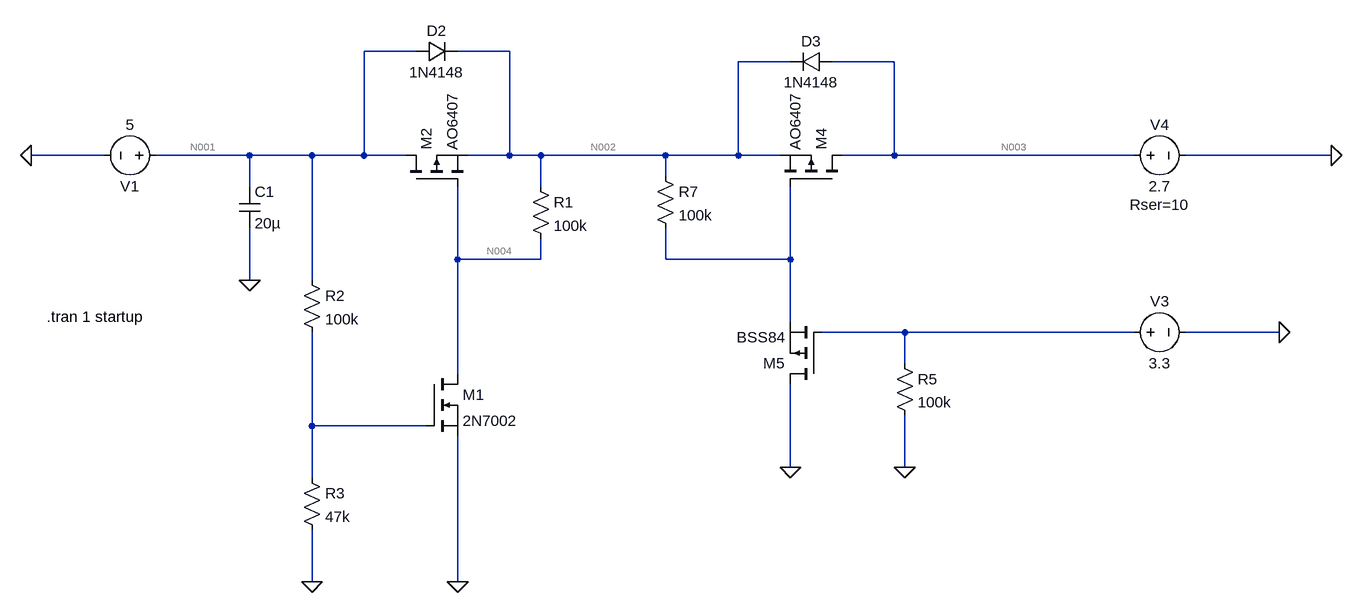
[diagram p0: schematic PV - Reverse current (BAT) protection.asc]
PV - Reverse current (BAT) protection.asc, the LTspice schematic file:
Version 4
SHEET 1 1476 2196
WIRE 48 1360 -32 1360
WIRE 192 1360 112 1360
WIRE 624 1376 544 1376
WIRE 784 1376 688 1376
WIRE -432 1520 -544 1520
WIRE -208 1520 -352 1520
WIRE -112 1520 -208 1520
WIRE -32 1520 -32 1360
WIRE -32 1520 -112 1520
WIRE 32 1520 -32 1520
WIRE 192 1520 192 1360
WIRE 192 1520 128 1520
WIRE 240 1520 192 1520
WIRE 432 1520 240 1520
WIRE 544 1520 544 1376
WIRE 544 1520 432 1520
WIRE 608 1520 544 1520
WIRE 784 1520 784 1376
WIRE 784 1520 704 1520
WIRE 1152 1520 784 1520
WIRE 1456 1520 1232 1520
WIRE 432 1552 432 1520
WIRE -208 1568 -208 1520
WIRE 240 1568 240 1520
WIRE 112 1680 112 1568
WIRE 240 1680 240 1648
WIRE 240 1680 112 1680
WIRE 432 1680 432 1632
WIRE 624 1680 624 1568
WIRE 624 1680 432 1680
WIRE -208 1712 -208 1632
WIRE -112 1712 -112 1520
WIRE 624 1776 624 1680
WIRE 800 1792 672 1792
WIRE 1152 1792 800 1792
WIRE 1376 1792 1232 1792
WIRE 800 1840 800 1792
WIRE 112 1856 112 1680
WIRE -112 1936 -112 1792
WIRE 64 1936 -112 1936
WIRE 624 2000 624 1872
WIRE 800 2000 800 1920
WIRE -112 2016 -112 1936
WIRE -112 2176 -112 2096
WIRE 112 2176 112 1952
FLAG -544 1520 0
FLAG -112 2176 0
FLAG 112 2176 0
FLAG -208 1712 0
FLAG 1376 1792 0
FLAG 1456 1520 0
FLAG 624 2000 0
FLAG 800 2000 0
SYMBOL nmos 64 1856 R0
SYMATTR InstName M1
SYMATTR Value 2N7002
SYMBOL pmos 32 1568 R270
SYMATTR InstName M2
SYMATTR Value AO6407
SYMBOL res 224 1552 R0
SYMATTR InstName R1
SYMATTR Value 100k
SYMBOL res -128 1696 R0
SYMATTR InstName R2
SYMATTR Value 100k
SYMBOL cap -224 1568 R0
SYMATTR InstName C1
SYMATTR Value 20µ
SYMBOL diode 48 1376 R270
WINDOW 0 32 32 VTop 2
WINDOW 3 0 32 VBottom 2
SYMATTR InstName D2
SYMATTR Value 1N4148
SYMBOL voltage -336 1520 R90
WINDOW 0 32 56 VTop 2
WINDOW 3 -32 56 VBottom 2
WINDOW 123 0 0 Left 0
WINDOW 39 0 0 Left 0
SYMATTR InstName V1
SYMATTR Value 5
SYMBOL res -128 2000 R0
SYMATTR InstName R3
SYMATTR Value 47k
SYMBOL pmos 704 1568 M270
SYMATTR InstName M4
SYMATTR Value AO6407
SYMBOL diode 688 1360 R90
WINDOW 0 0 32 VBottom 2
WINDOW 3 32 32 VTop 2
SYMATTR InstName D3
SYMATTR Value 1N4148
SYMBOL voltage 1136 1792 R270
WINDOW 0 32 56 VTop 2
WINDOW 3 -32 56 VBottom 2
WINDOW 123 0 0 Left 0
WINDOW 39 0 0 Left 0
SYMATTR InstName V3
SYMATTR Value 3.3
SYMBOL voltage 1136 1520 R270
WINDOW 0 32 56 VTop 2
WINDOW 3 -32 56 VBottom 2
WINDOW 123 0 0 Left 0
WINDOW 39 -60 56 VBottom 2
SYMATTR InstName V4
SYMATTR Value 2.7
SYMATTR SpiceLine Rser=10
SYMBOL pmos 672 1872 R180
SYMATTR InstName M5
SYMATTR Value BSS84
SYMBOL res 784 1824 R0
SYMATTR InstName R5
SYMATTR Value 100k
SYMBOL res 416 1536 R0
SYMATTR InstName R7
SYMATTR Value 100k
TEXT -520 1768 Left 2 !.tran 1 startup

The netlist it stands for:
* PV - Reverse current (BAT) protection.asc
M1 N004 N007 0 0 2N7002
M2 N001 N004 N002 N002 AO6407
R1 N002 N004 100k
R2 N001 N007 100k
C1 N001 0 20µ
D2 N001 N002 1N4148
V1 N001 0 5
R3 N007 0 47k
M4 N003 N005 N002 N002 AO6407
D3 N003 N002 1N4148
V3 N006 0 3.3
V4 N003 0 2.7 Rser=10
M5 0 N006 N005 N005 BSS84
R5 N006 0 100k
R7 N002 N005 100k
.model D D
.lib standard.dio
.model NMOS NMOS
.model PMOS PMOS
.lib standard.mos
.tran 1 startup
.backanno
.end

* Results of the author's LTspice run, read from the files saved beside the schematic
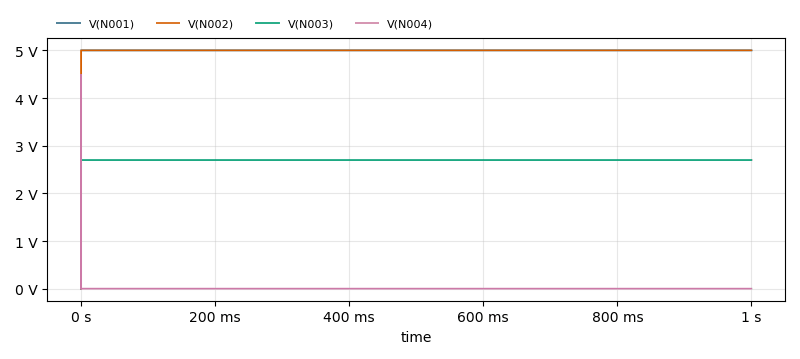
[diagram p1: Transient Analysis of PV - Reverse current (BAT) protection.asc, plotted from the saved traces]
* Transient Analysis, 1 run:
*   V(N001): min 0 V, max 5 V, average 5 V, rms 5 V, last 5 V
*   V(N002): min 0 V, max 5 V, average 5 V, rms 5 V, last 5 V
*   V(N003): min 0 V, max 2.702 V, average 2.7 V, rms 2.7 V, last 2.7 V
*   V(N004): min 0 V, max 4.487 V, average 3.764 mV, rms 23.07 mV, last 3.578 mV